# Altium schematic sheet MCU.SchDoc
size A; SheetNumber: 1; SheetTotal: 2
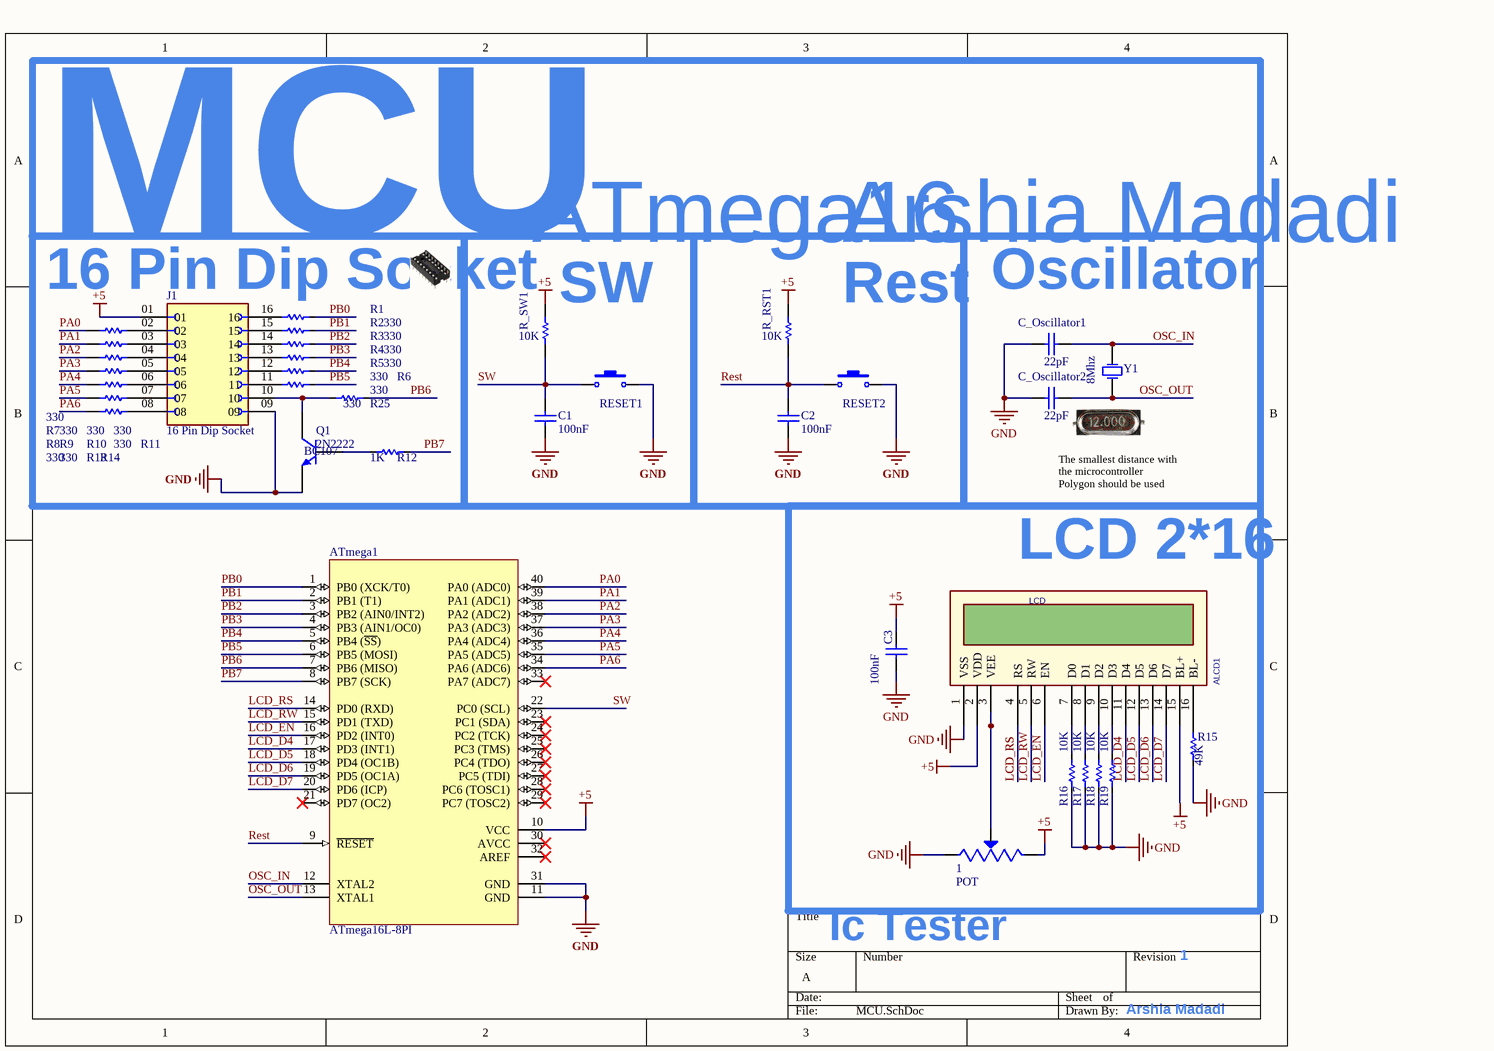
[diagram p0: MCU.SchDoc]

## Parts
1  POT  [TRIM_3296W1103LF]
ALCD1  LCD  [LCD_2X16 BLUE - 2.5mm]
ATmega1  ATmega16L-8PI  [40P6]
C1  100nF  [CAPC4817X12N]
C2  100nF  [CAPC4817X12N]
C3  100nF  [CAPC4817X12N]
C_Oscillator1  22pF  [CAPC4817X12N]
C_Oscillator2  22pF  [CAPC4817X12N]
J1  16 Pin Dip Socket  [AMPHENOL_DILB16P-223TLF]
Q1  2N2222  [2N2222]
R1  330  [1206_Res]
R2  330  [1206_Res]
R3  330  [1206_Res]
R4  330  [1206_Res]
R5  330  [1206_Res]
R6  330  [1206_Res]
R7  330  [RESC4817X04N]
R8  330  [RESC4817X04N]
R9  330  [RESC4817X04N]
R10  330  [RESC4817X04N]
R11  330  [RESC4817X04N]
R12  1K  [1206_Res]
R13  330  [RESC4817X04N]
R14  330  [RESC4817X04N]
R15  49K  [1206_Res]
R16  10K  [1206_Res]
R17  10K  [1206_Res]
R18  10K  [1206_Res]
R19  10K  [1206_Res]
R25  330  [1206_Res]
R_RST1  10K  [RESC4817X04N]
R_SW1  10K  [RESC4817X04N]
RESET1  Switch PB  [Switch - Push to On]  (value not drawn)
RESET2  Switch PB  [Switch - Push to On]  (value not drawn)
Y1  8Mhz  [Crystal]

## Blocks framed on the sheet
MCU: J1 Q1 R1-R14 R25
ATmega16: C1 R_SW1 RESET1
Arshia Madadi: C2 R_RST1 RESET2
Oscillator: C_Oscillator1 C_Oscillator2 Y1
LCD 2*16: 1 ALCD1 C3 R15-R19

## Nets
+5: 1.3(CW) ALCD1.2(VDD) ALCD1.15(BL+) ATmega1.10(VCC) C3.2 J1.01 R_RST1.2 R_SW1.2
GND: 1.1(CCW) ALCD1.1(VSS) ATmega1.11(GND) ATmega1.31(GND) C1.1 C2.1 C3.1 C_Oscillator1.1 C_Oscillator2.1 J1.09 Q1.1(E) R15.2 R16.1 R17.1 R18.1 R19.1 RESET1.2 RESET2.2
LCD_D4: ALCD1.11(D4) ATmega1.17(PD3_(INT1))
LCD_D5: ALCD1.12(D5) ATmega1.18(PD4_(OC1B))
LCD_D6: ALCD1.13(D6) ATmega1.19(PD5_(OC1A))
LCD_D7: ALCD1.14(D7) ATmega1.20(PD6_(ICP))
LCD_EN: ALCD1.6(EN) ATmega1.16(PD2_(INT0))
LCD_RS: ALCD1.4(RS) ATmega1.14(PD0_(RXD))
LCD_RW: ALCD1.5(RW) ATmega1.15(PD1_(TXD))
OSC_IN: ATmega1.12(XTAL2) C_Oscillator1.2 Y1.2(OSC2)
OSC_OUT: ATmega1.13(XTAL1) C_Oscillator2.2 Y1.1(OSC1)
PA0: ATmega1.40(PA0_(ADC0)) R10.2
PA1: ATmega1.39(PA1_(ADC1)) R9.2
PA2: ATmega1.38(PA2_(ADC2)) R14.2
PA3: ATmega1.37(PA3_(ADC3)) R13.2
PA4: ATmega1.36(PA4_(ADC4)) R11.2
PA5: ATmega1.35(PA5_(ADC5)) R8.2
PA6: ATmega1.34(PA6_(ADC6)) R7.2
PB0: ATmega1.1(PB0_(XCK/T0)) R1.1
PB1: ATmega1.2(PB1_(T1)) R2.1
PB2: ATmega1.3(PB2_(AIN0/INT2)) R3.1
PB3: ATmega1.4(PB3_(AIN1/OC0)) R4.1
PB4: ATmega1.5(PB4_(~{SS})) R5.1
PB5: ATmega1.6(PB5_(MOSI)) R6.1
PB6: ATmega1.7(PB6_(MISO)) R25.1
PB7: ATmega1.8(PB7_(SCK)) R12.1
Rest: ATmega1.9(~{RESET}) C2.2 R_RST1.1 RESET2.1
SW: ATmega1.22(PC0_(SCL)) C1.2 R_SW1.1 RESET1.1
Net1_2: 1.2(WIPER) ALCD1.3(VEE)
NetALCD1_7: ALCD1.7(D0) R16.2
NetALCD1_8: ALCD1.8(D1) R17.2
NetALCD1_9: ALCD1.9(D2) R18.2
NetALCD1_10: ALCD1.10(D3) R19.2
NetALCD1_16: ALCD1.16(BL-) R15.1
NetJ1_02: J1.02 R10.1
NetJ1_03: J1.03 R9.1
NetJ1_04: J1.04 R14.1
NetJ1_05: J1.05 R13.1
NetJ1_06: J1.06 R11.1
NetJ1_07: J1.07 R8.1
NetJ1_08: J1.08 R7.1
NetJ1_10: J1.10 Q1.3(C) R25.2
NetJ1_11: J1.11 R6.2
NetJ1_12: J1.12 R5.2
NetJ1_13: J1.13 R4.2
NetJ1_14: J1.14 R3.2
NetJ1_15: J1.15 R2.2
NetJ1_16: J1.16 R1.2
NetQ1_2: Q1.2(B) R12.2

Not connected (* = marked no-connect by the designer): ATmega1 21(PD7_(OC2))* 23(PC1_(SDA))* 24(PC2_(TCK))* 25(PC3_(TMS))* 26(PC4_(TDO))* 27(PC5_(TDI))* 28(PC6_(TOSC1))* 29(PC7_(TOSC2))* 30(AVCC)* 32(AREF)* 33(PA7_(ADC7))*

## Notes on the sheet
- 16 Pin Dip Socket
- (near R_SW1) SW
- Rest
- The smallest distance with the microcontroller
  Polygon should be used
- (near 1) Ic Tester
- 1
- Arshia Madadi
- (in symbol 2N2222) BC107

## Library data of the parts
1 = 3296W1103LF: Trimmer, Potentiometer 10kohm 25turn Thd; MF: Bourns; Package: None; MP: 3296W1103LF; Check_prices: https://www.snapeda.com/parts/3296W1103LF/Bourns/view-part/2487625/?ref=eda; Availability: Unavailable; Price: None; Value: *; SnapEDA_Link: https://www.snapeda.com/parts/3296W1103LF/Bourns/view-part/2487625/?ref=snap
ALCD1 = LCD: Alphanumic LCD; Designer: Abbas Basereh; Data: 16-12-2016
ATmega1 = ATmega16L-8PI: 8-Bit AVR Microcontroller with 16K Bytes of In-System Programmable Flash Memory; Published: 2017-1-4; DatasheetVersion: 2466E-AVR-10/02; PackageVersion: 2017-1-4; PackageReference: 40P6; Publisher: Abbas Basereh; PackageDescription: 40-lead (0.600"/15.24mm Wide) Plastic Dual Inline Package (PDIP); Supplier 1: Digi-Key; Supplier Part Number 1: ATMEGA16L-8PI-ND; Supplier 2: Mouser; Supplier Part Number 2: 556-ATMEGA16L-8PI; Code_JEDEC: MS-011-AC; ComponentLink1Description: Datasheet; ComponentLink1URL: http://www.atmel.com/dyn/resources/prod_documents/doc2466.pdf; ComponentLink2Description: Atmel.com Home; ComponentLink2URL: http://www.atmel.com
C1-C3 C_Oscillator1 C_Oscillator2 = CAP SMD 1206: CAP 1206; Designer: Abbas Basereh; Desc.: CAP SMD 1206; Data: 16-12-2016
J1 = DILB16P-223TLF: DIP Socket, Stamped and Formed; MF: Amphenol ICC (FCI); Check_prices: https://www.snapeda.com/parts/DILB16P-223TLF/Amphenol+FCI/view-part/?ref=eda; Package: None; Price: None; Value: *; MP: DILB16P-223TLF; SnapEDA_Link: https://www.snapeda.com/parts/DILB16P-223TLF/Amphenol+FCI/view-part/?ref=snap; Availability: In Stock
Q1 = 2N2222: NPN Transistor
R1-R6 R12 R15-R19 R25 = Res: Resistor; Published: 8-Jun-2000; LatestRevisionDate: 17-Jul-2002; LatestRevisionNote: Re-released for DXP Platform.; PackageReference: AXIAL-0.3; Publisher: Altium Limited
R7-R11 R13 R14 R_RST1 R_SW1 = RES 1206 0.25W: RES 1206; Designer: Abbas Basereh; Desc.: RES SMD 1206; Data: 16-12-2016
RESET1 RESET2 = Switch PB: Push Button Switch
Y1 = XTAL: Crystal Oscillator; Published: 8-Jun-2000; LatestRevisionDate: 17-Jul-2002; LatestRevisionNote: Re-released for DXP Platform.; PackageReference: R38; Publisher: Altium Limited